# EAGLE design OV_FPC (EAGLE 5.11)
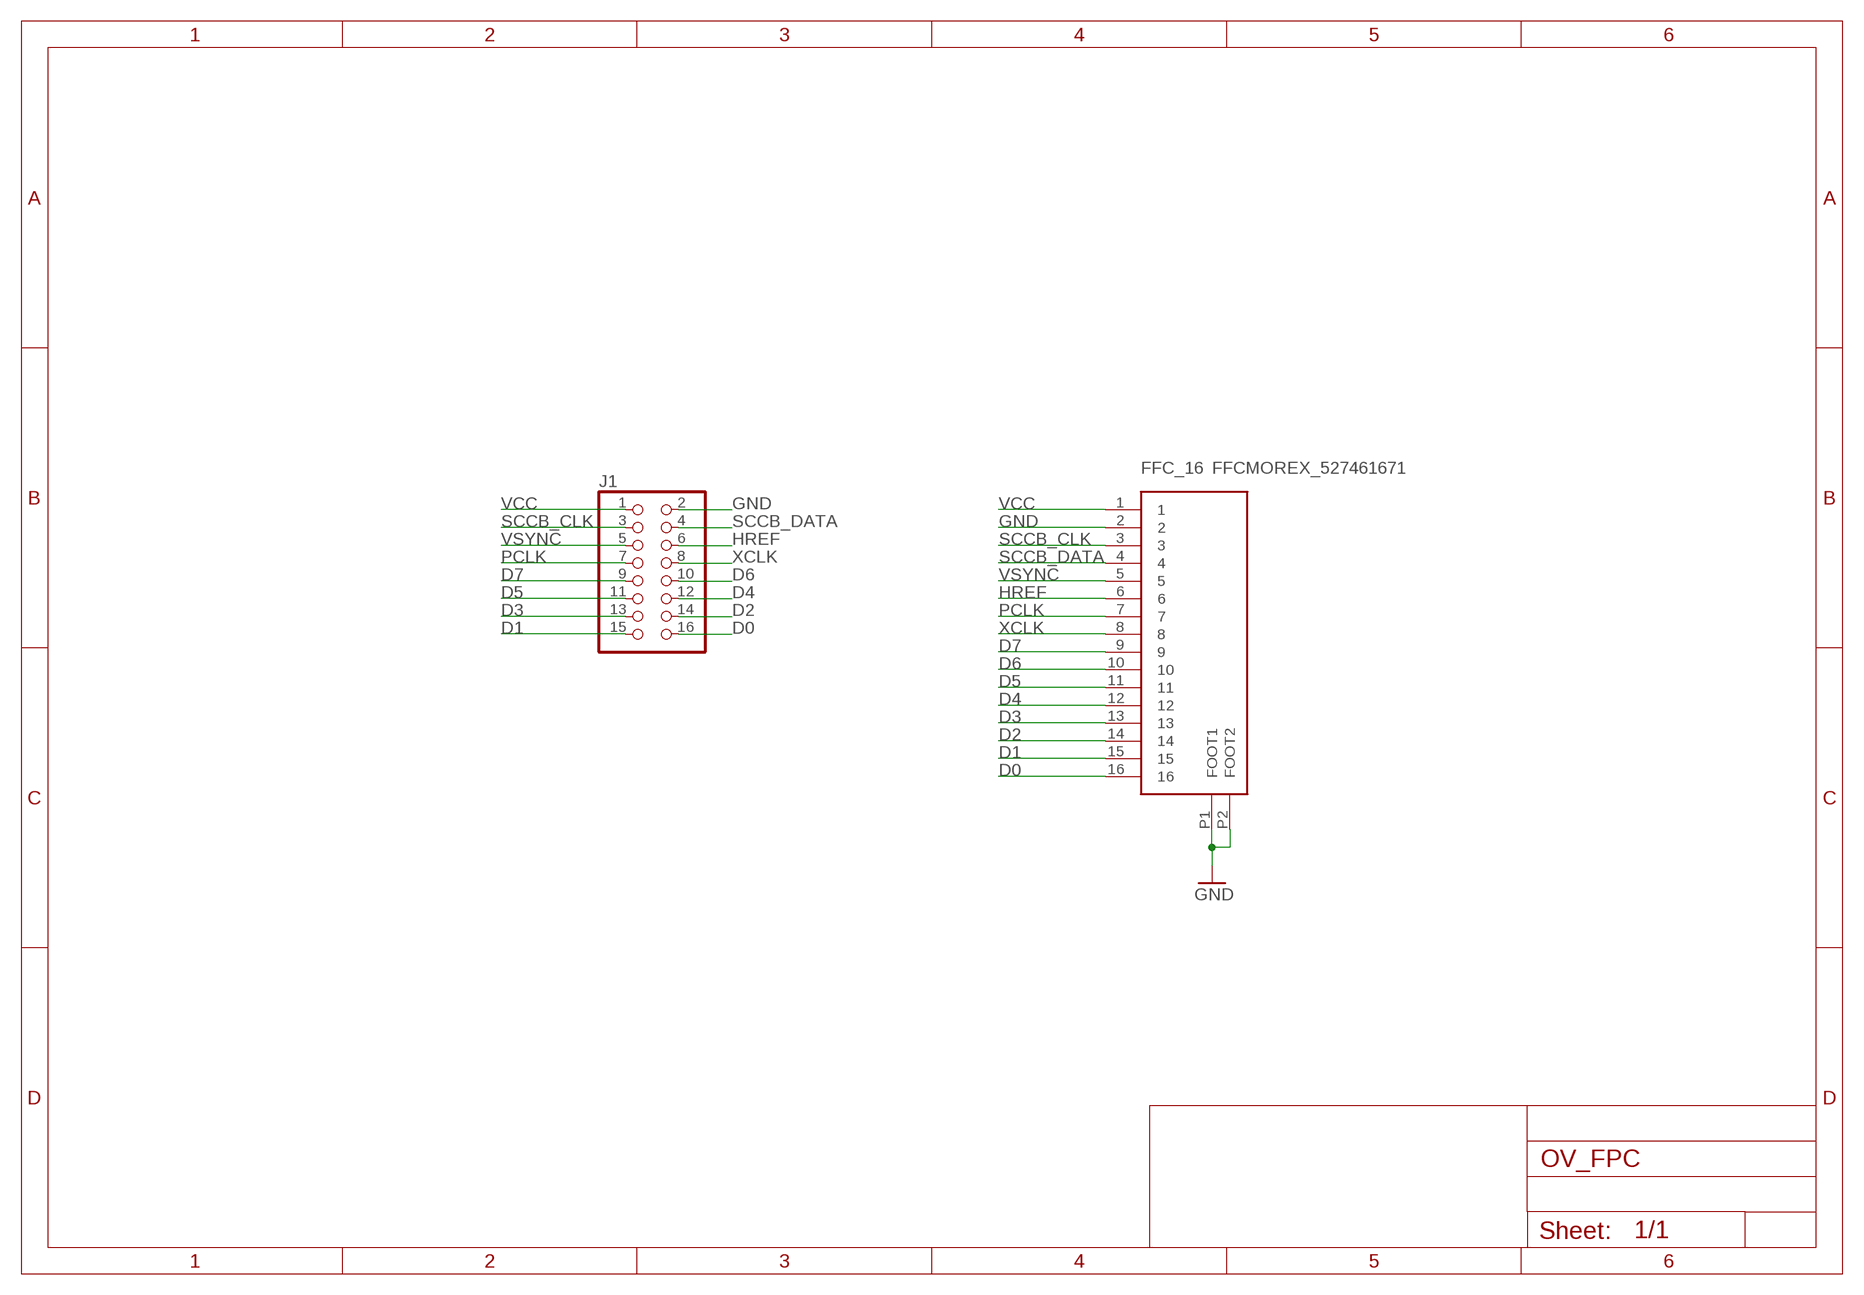
[diagram p0: schematic, sheet 1]

## Parts
FFC_16  FFCMOREX_527461671  [MOREX_527461671]
J1  PINHD-2X8  [2X08]

## Nets
D0: FFC_16.16 J1.16
D1: FFC_16.15 J1.15
D2: FFC_16.14 J1.14
D3: FFC_16.13 J1.13
D4: FFC_16.12 J1.12
D5: FFC_16.11 J1.11
D6: FFC_16.10 J1.10
D7: FFC_16.9 J1.9
GND: FFC_16.2 FFC_16.P1(FOOT1) FFC_16.P2(FOOT2) J1.2
HREF: FFC_16.6 J1.6
PCLK: FFC_16.7 J1.7
SCCB_CLK: FFC_16.3 J1.3
SCCB_DATA: FFC_16.4 J1.4
VCC: FFC_16.1 J1.1
VSYNC: FFC_16.5 J1.5
XCLK: FFC_16.8 J1.8

## Library data of the parts
FFC_16 = FPC:FFCMOREX_527461671
J1 = Basic:PINHD-2X8: PIN HEADER

## Board
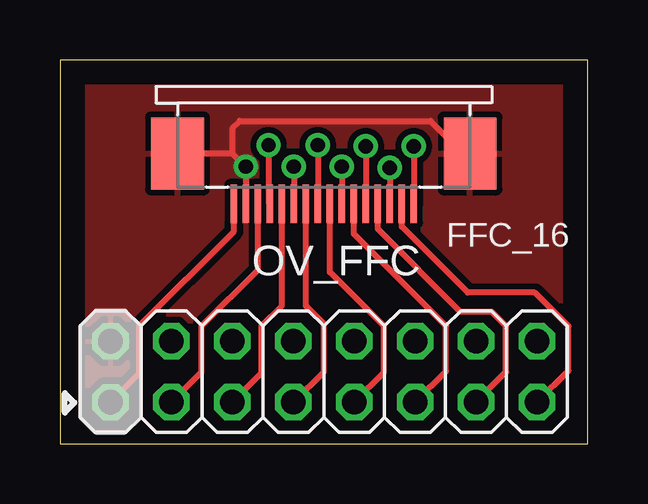
[diagram p1: board, top side]
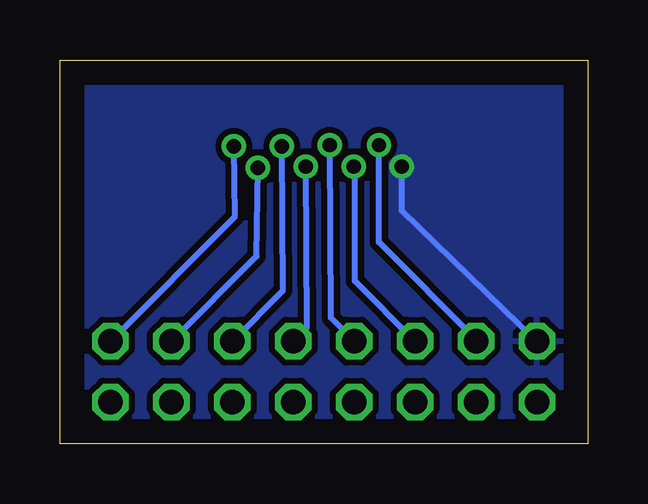
[diagram p2: board, bottom side, seen from below]

Size 22 x 16 mm. Coordinates in mm from the lower left corner, seen from the top.
Outline: 0,0 22,0 22,16 0,16 0,0
Copper layers (1*16): Top 0.035mm / dielectric 1.5mm / Bottom 0.035mm
Design rules "default": minimum track width 10mil, minimum drill 24mil, track to track 8mil, track to pad 8mil, pad to pad 8mil, via to via 8mil, smd to smd 8mil, copper to edge 40mil, drill to drill 8mil, minimum pad ring 10mil, minimum via ring 8mil, stop-mask expansion 4mil, vias tented up to drill 0mil, thermal gap 10mil

### Footprints (pad centres in the part's own frame; a part is rotated, then mirrored left to right if it is on the bottom)
MOREX_527461671 = smd 0.28 x 1.6: 1 -3.75,0; 2 -3.25,0; 3 -2.75,0; 4 -2.25,0; 5 -1.75,0; 6 -1.25,0; 7 -0.75,0; 8 -0.25,0; 9 0.25,0; 10 0.75,0; 11 1.25,0; 12 1.75,0; 13 2.25,0; 14 2.75,0; 15 3.25,0; 16 3.75,0 | smd 2.2 x 3: P1 -6.1,2.1; P2 6.1,2.1
2X08 = drill 1.016 octagon: 1 -8.89,-1.27; 2 -8.89,1.27; 3 -6.35,-1.27; 4 -6.35,1.27; 5 -3.81,-1.27; 6 -3.81,1.27; 7 -1.27,-1.27; 8 -1.27,1.27; 9 1.27,-1.27; 10 1.27,1.27; 11 3.81,-1.27; 12 3.81,1.27; 13 6.35,-1.27; 14 6.35,1.27; 15 8.89,-1.27; 16 8.89,1.27

### Placement (x,y rotation side)
FFC_16  11,10 0 top
J1  11,3 0 top

### Tracks (layer width: path | path; a pad name or v marks a point on that pad's centre or on a via)
D0  (via drill 0.6)
  Top 0.254: v14.75,12.4 FFC_16.16
  Bottom 0.254: v14.75,12.4 14.7,9.46 J1.16
D1
  Top 0.254: FFC_16.15 14.25,9.05 17,6.3 19.8,6.3 21.2,4.9 21.2,3.04 J1.15
D2  (via drill 0.6)
  Top 0.254: v13.75,11.5 FFC_16.14
  Bottom 0.254: v13.75,11.5 13.8,7.82 J1.14
D3
  Top 0.254: FFC_16.13 13.25,8.95 16.7,5.5 18,5.5 18.6,4.9 18.6,2.98 J1.13
D4  (via drill 0.6)
  Top 0.254: v12.75,12.4 FFC_16.12
  Bottom 0.254: v12.75,12.4 12.7,6.38 J1.12
D5
  Top 0.254: FFC_16.11 12.25,8.75 16.1,4.9 16.1,3.02 J1.11
D6  (via drill 0.6)
  Top 0.254: v11.75,11.55 FFC_16.10
  Bottom 0.254: v11.75,11.55 11.7,4.84 J1.10
D7
  Top 0.254: FFC_16.9 11.25,7.15 13.5,4.9 13.5,2.96 J1.9
GND  (via drill 0.6)
  Top 0.254: FFC_16.2 v7.75,11.55 7.2,12.1 | 7.2,12.1 FFC_16.P1 | FFC_16.P2 16.8,12.1 15.45,13.45 7.5,13.45 7.2,13.15 7.2,12.1
  Bottom 0.254: v7.75,11.55 7.75,9.71 J1.2
  pour Top (isolate 0.254): 0,16 22,16 22,0 0,0
  pour Bottom (isolate 0.254): 0,16 0,0 22,0 22,16
HREF  (via drill 0.6)
  Top 0.254: FFC_16.6 9.75,11.5 v9.75,11.55
  Bottom 0.254: v9.75,11.55 9.7,11.35 9.7,6.78 J1.6
PCLK
  Top 0.254: FFC_16.7 10.25,5.75 11,5 11,3 J1.7
SCCB_CLK
  Top 0.254: FFC_16.3 8.25,7.25 5.9,4.9 5.9,2.98 J1.3
SCCB_DATA  (via drill 0.6)
  Top 0.254: v8.7,12.45 8.7,10.05 FFC_16.4
  Bottom 0.254: J1.4 4.65,4.35 8.7,8.4 v8.7,12.45 8.7,12.5
VCC
  Top 0.254: FFC_16.1 7.25,8.85 3.3,4.9 3.3,2.92 J1.1
VSYNC
  Top 0.254: FFC_16.5 9.25,5.75 8.4,4.9 8.4,2.94 J1.5
XCLK  (via drill 0.6)
  Top 0.254: FFC_16.8 10.75,12.4 v10.75,12.45
  Bottom 0.254: v10.75,12.45 10.7,5.24 J1.8

### Text on the board
tPlace: OV_FFC